# EAGLE schematic seven_step_with_rot_encoder (EAGLE 5.07)
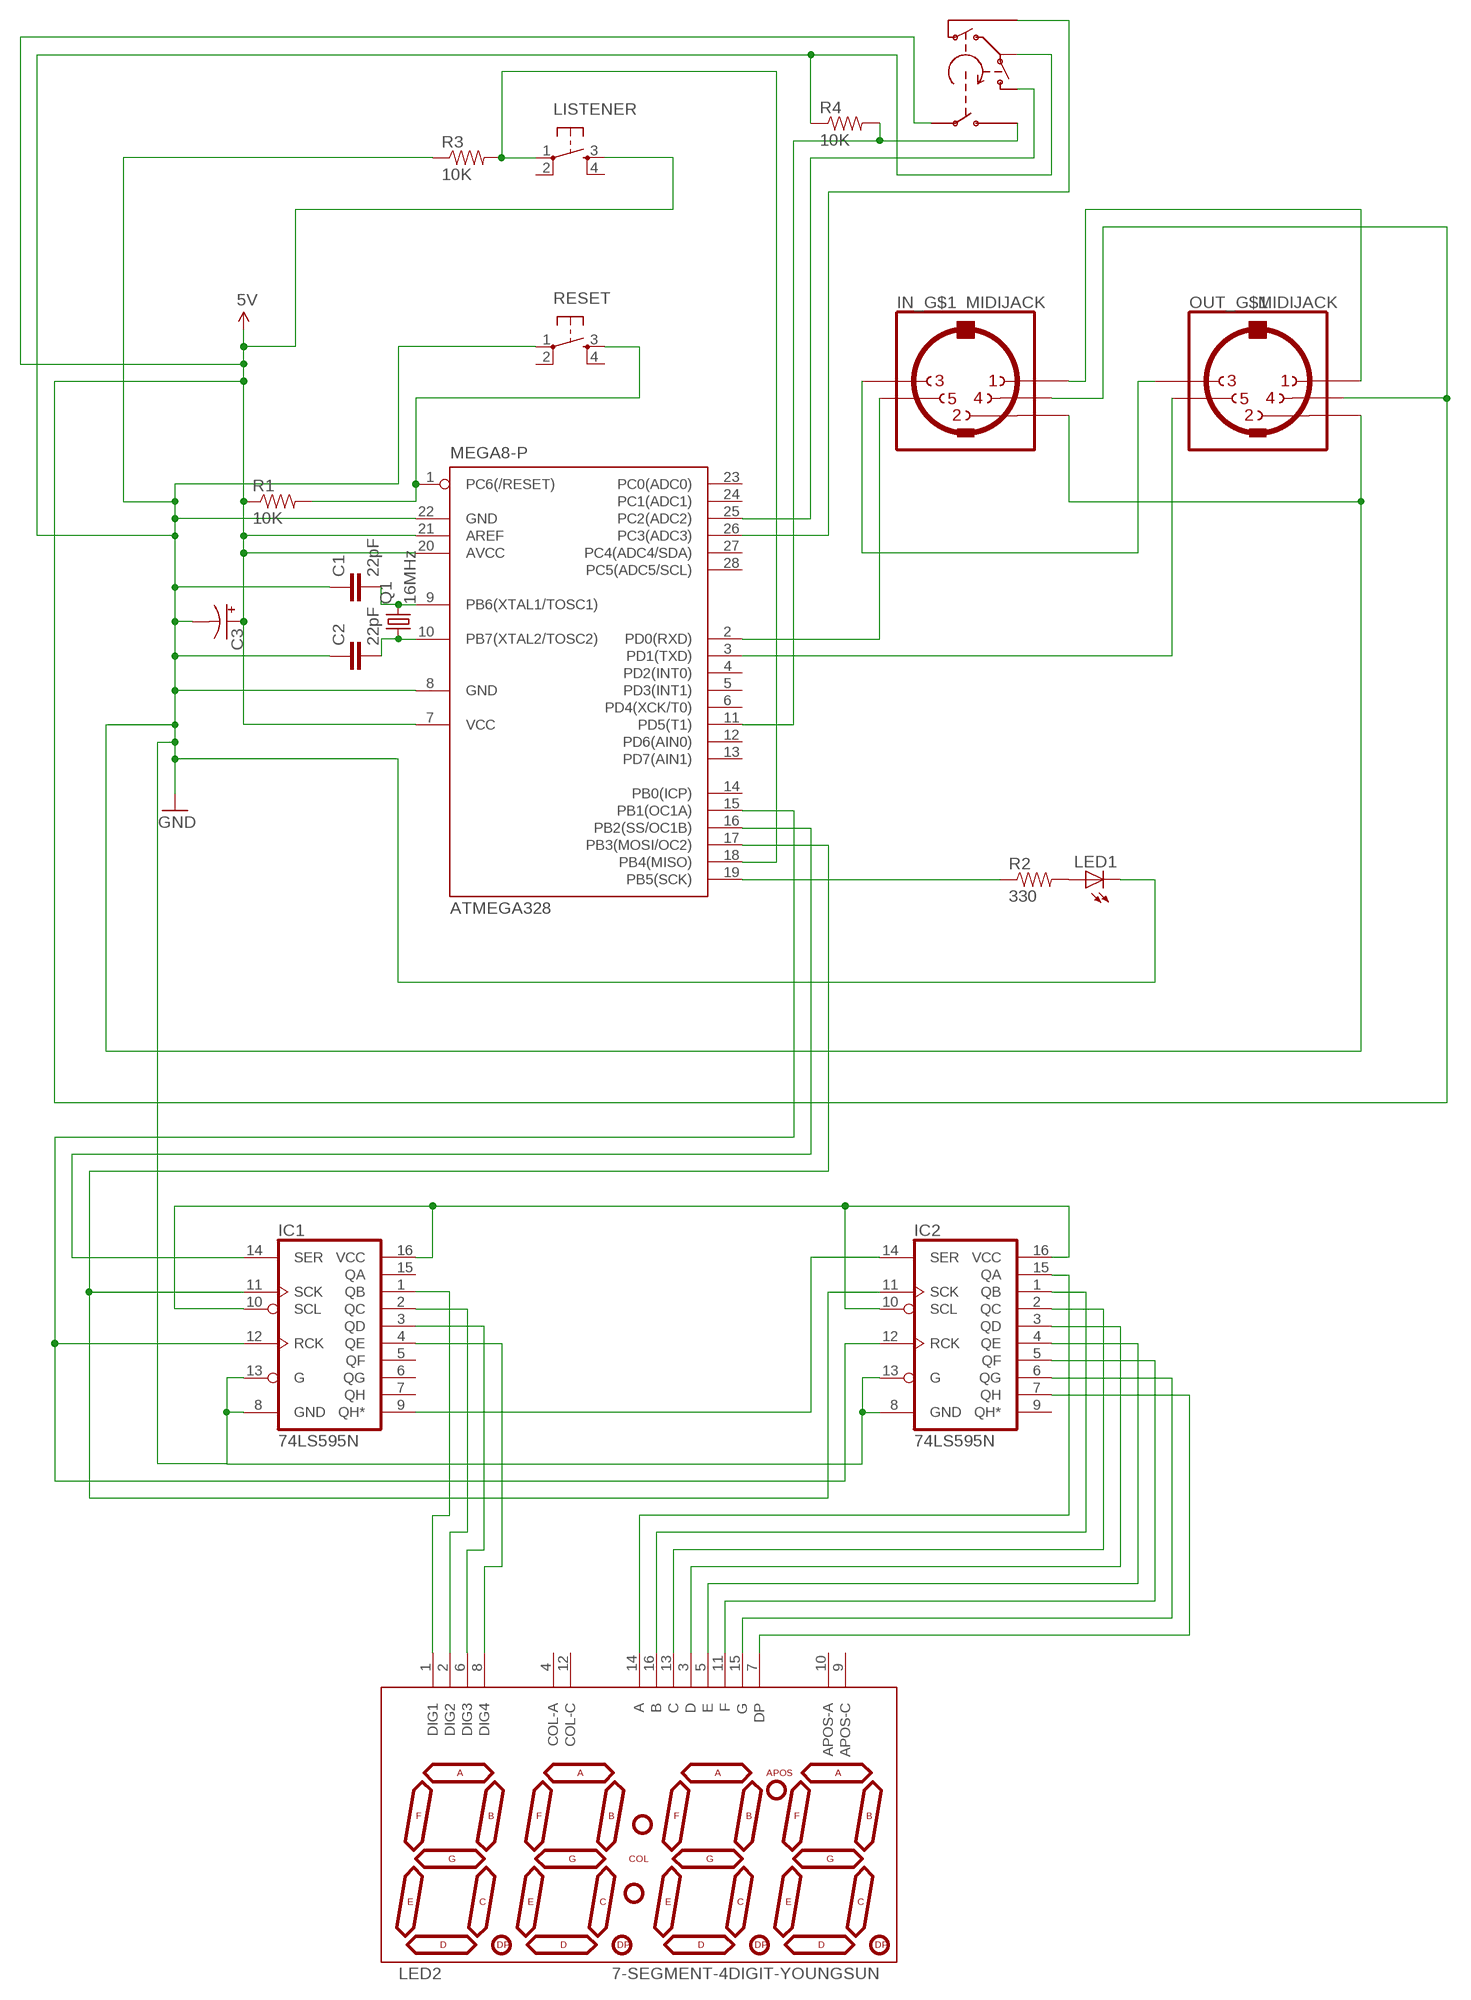
[diagram p0: schematic, sheet 1]

## Parts
ATMEGA328  MEGA8-P  [DIL28-3]
C1  22pF  CAPPTH  [CAP-PTH-SMALL]
C2  22pF  CAPPTH  [CAP-PTH-SMALL]
C3  CAP_POLPTH2  [CPOL-RADIAL-10UF-25V]
IC1  74LS595N  [DIL16]
IC2  74LS595N  [DIL16]
IN_  MIDIJACK  [CP-2350]
LED1  LED5MM  [LED5MM]
LED2  7-SEGMENT-4DIGIT-YOUNGSUN  [7-SEGMENT-4DIGIT-YOUNGSUN]
LISTENER  TAC_SWITCHPTH  [TACTILE-PTH]
OUT_  MIDIJACK  [CP-2350]
Q1  16MHz  CRYSTALHC49U-V  [HC49U-V]
R1  10K  RESISTORPTH-1/6W  [1/6W-RES]
R2  330  RESISTORPTH-1/6W  [1/6W-RES]
R3  10K  RESISTORPTH-1/6W  [1/6W-RES]
R4  10K  RESISTORPTH-1/6W  [1/6W-RES]
RESET  TAC_SWITCHPTH  [TACTILE-PTH]
U$2  ALPHA-ROT-ENCODER  [TW-700198]

## Nets
5V: ATMEGA328.7(VCC) ATMEGA328.20(AVCC) ATMEGA328.21(AREF) C3.1(+) IN_.4 LISTENER.3 OUT_.4 R1.1 U$2.P4(S1)
GND: ATMEGA328.8(GND) ATMEGA328.22(GND) C1.1 C2.1 C3.2(-) IC1.8(GND) IC1.13(G) IC2.8(GND) IC2.13(G) IN_.2 LED1.K(C) OUT_.2 R3.1 R4.1 RESET.1 U$2.P2(COM)
N$1: ATMEGA328.1(PC6(/RESET)) R1.2 RESET.3
N$2: ATMEGA328.9(PB6(XTAL1/TOSC1)) C1.2 Q1.2
N$3: ATMEGA328.10(PB7(XTAL2/TOSC2)) C2.2 Q1.1
N$5: ATMEGA328.2(PD0(RXD)) IN_.5
N$6: ATMEGA328.3(PD1(TXD)) OUT_.5
N$7: IN_.3 OUT_.3
N$8: IN_.1 OUT_.1
N$9: ATMEGA328.16(PB2(SS/OC1B)) IC1.14(SER)
N$10: IC1.10(SCL) IC1.16(VCC) IC2.10(SCL) IC2.16(VCC)
N$11: ATMEGA328.15(PB1(OC1A)) IC1.12(RCK) IC2.12(RCK)
N$12: ATMEGA328.19(PB5(SCK)) R2.1
N$13: LED1.A R2.2
N$15: ATMEGA328.18(PB4(MISO)) LISTENER.1 R3.2
N$16: ATMEGA328.17(PB3(MOSI/OC2)) IC1.11(SCK) IC2.11(SCK)
N$17: IC2.5(QF) LED2.11(F)
N$18: IC1.9(QH*) IC2.14(SER)
N$19: IC1.1(QB) LED2.1(DIG1)
N$20: IC1.2(QC) LED2.2(DIG2)
N$21: IC1.3(QD) LED2.6(DIG3)
N$22: IC1.4(QE) LED2.8(DIG4)
N$23: IC2.15(QA) LED2.14(A)
N$24: IC2.1(QB) LED2.16(B)
N$25: IC2.2(QC) LED2.13(C)
N$26: IC2.3(QD) LED2.3(D)
N$27: IC2.4(QE) LED2.5(E)
N$28: IC2.6(QG) LED2.15(G)
N$29: IC2.7(QH) LED2.7(DP)
N$30: ATMEGA328.11(PD5(T1)) R4.2 U$2.P5(S2)
N$31: ATMEGA328.26(PC3(ADC3)) U$2.P3(A)
N$32: ATMEGA328.25(PC2(ADC2)) U$2.P1(B)
Unconnected: ATMEGA328.4(PD2(INT0)) ATMEGA328.5(PD3(INT1)) ATMEGA328.6(PD4(XCK/T0)) ATMEGA328.12(PD6(AIN0)) ATMEGA328.13(PD7(AIN1)) ATMEGA328.14(PB0(ICP)) ATMEGA328.23(PC0(ADC0)) ATMEGA328.24(PC1(ADC1)) ATMEGA328.27(PC4(ADC4/SDA)) ATMEGA328.28(PC5(ADC5/SCL)) IC1.5(QF) IC1.6(QG) IC1.7(QH) IC1.15(QA) IC2.9(QH*) IN_.PE1(MT) IN_.PE2(MT) IN_.PE(MT) IN_.PE@(MT) LED2.4(COL-A) LED2.9(APOS-C) LED2.10(APOS-A) LED2.12(COL-C) LISTENER.2 LISTENER.4 OUT_.PE1(MT) OUT_.PE2(MT) OUT_.PE(MT) OUT_.PE@(MT) RESET.2 RESET.4

## Library data of the parts
ATMEGA328 = atmel:MEGA8-P: MICROCONTROLLER 8 Kbytes FLASH, 1 kbytes SRAM, 512 bytes EEPROM, USART, 4-channel 10 bit ADC, 2-channel 8 bit ADC Pin compatible with Atmega48, ATMega88, ATMega168 Source: avr.lbr
C1 C2 = SparkFun:CAP: Capacitor Standard 0603 ceramic capacitor, and 0.1" leaded capacitor.
C3 = SparkFun:CAP_POL: Capacitor Polarized These are standard SMD and PTH capacitors. Normally 10uF, 47uF, and 100uF in electrolytic and tantalum varieties. Always verify the external diameter of the through hole cap, it varies with capacity, voltage, and manufacturer. The EIA devices should be standard.
IC1 IC2 = SparkFun:74*595: 8-bit SHIFT REGISTER, output latch
IN_ OUT_ = adafruit:MIDIJACK: DIN 5 jack also known as MIDI jack A modification of conn-hirshman:MAB5SH with two options for the grounding 'teeth'
LED1 = adafruit:LED: LED OSRAM: - CHIPLED LG R971, LG N971, LY N971, LG Q971, LY Q971, LO R971, LY R971 LH N974, LH R974 LS Q976, LO Q976, LY Q976 LO Q996 - Hyper CHIPLED LW Q18S LB Q993, LB Q99A, LB R99A - SideLED LS A670, LO A670, LY A670, LG A670, LP A670 LB A673, LV A673, LT A673, LW A673 LH A674 LY A675 LS A676, LA A676, LO A676, LY A676, LW A676 LS A679, LY A679, LG A679 - Hyper Micro SIDELED® LS Y876, LA Y876, LO Y876, LY Y876 LT Y87S - SmartLED LW L88C, LW L88S LB L89C, LB L89S, LG L890 LS L89K, LO L89K, LY L89K LS L896, LA L896, LO L896, LY L896 - TOPLED LS T670, LO T670, LY T670, LG T670, LP T670 LSG T670, LSP T670, LSY T670, LOP T670, LYG T670 LG T671, LOG T671, LSG T671 LB T673, LV T673, LT T673, LW T673 LH T674 LS T676, LA T676, LO T676, LY T676, LB T676, LH T676, LSB T676, LW T676 LB T67C, LV T67C, LT T67C, LS T67K, LO T67K, LY T67K, LW E67C LS E67B, LA E67B, LO E67B, LY E67B, LB E67C, LV E67C, LT E67C LW T67C LS T679, LY T679, LG T679 LS T770, LO T770, LY T770, LG T770, LP T770 LB T773, LV T773, LT T773, LW T773 LH T774 LS E675, LA E675, LY E675, LS T675 LS T776, LA T776, LO T776, LY T776, LB T776 LHGB T686 LT T68C, LB T68C - Hyper Mini TOPLED® LB M676 - Mini TOPLED Santana® LG M470 LS M47K, LO M47K, LY M47K Source: http://www.osram.convergy.de/
LED2 = SparkFun:7-SEGMENT-4DIGIT-YOUNGSUN: This is a part for the 4-Digit 7-segment LEDs from Young Sun. Different from the Digikey LEDs, all 16 pins are used. The LONGPADS Variant is used for a test jig, but you may like it because there is more pad to solder to. If you are concerned about routing space, the standard works just fine though.
LISTENER RESET = SparkFun:TAC_SWITCH: Momentary Switch Button commonly used for reset or general input. Spark Fun Electronics SKU : COM-00097
Q1 = crystal:CRYSTAL: CRYSTAL
R1-R4 = SparkFun:RESISTOR: Resistor Basic schematic elements and footprints for 0603, 1206, and PTH resistors.
U$2 = RotaryEncoder:ALPHA-ROT-ENCODER